# Altium schematic sheet AFE.SchDoc
size A4; SheetNumber: 3; SheetTotal: 6
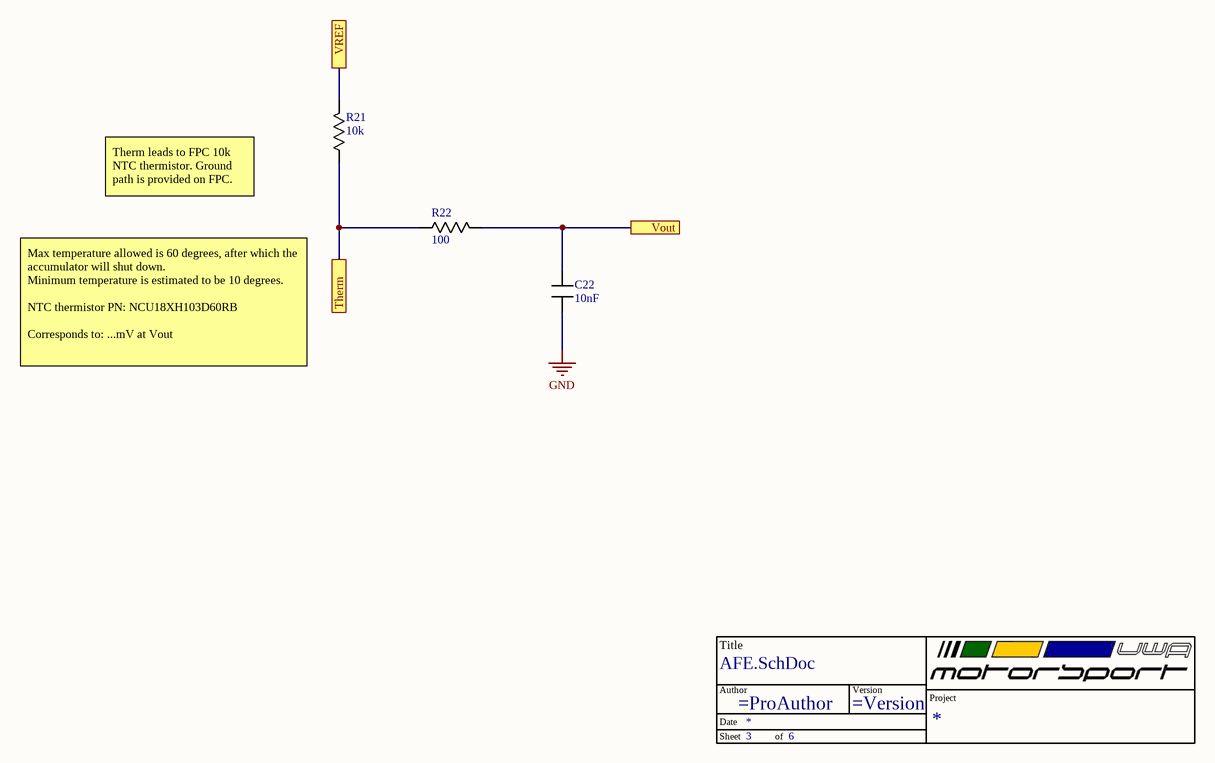
[diagram p0: AFE.SchDoc]

## Parts
*  TitleBlock  (value not drawn)  (graphical)
C22  value 10nF  [C_0603]  (hidden comment: C)
R21  value 10k  [R-0603]  (hidden comment: CRT0603-BY-1002EST)
R22  value 100  [R-0603]  (hidden comment: Resistor)

## Ports
Therm, Vout, VREF

## Nets
GND: C22.1
Therm: R21.1 R22.1 ; port Therm
Vout: C22.2 R22.2 ; port Vout
VREF: R21.2 ; port VREF

## Notes on the sheet
- Therm leads to FPC 10k NTC thermistor. Ground path is provided on FPC.
- Max temperature allowed is 60 degrees, after which the accumulator will shut down.
  Minimum temperature is estimated to be 10 degrees.
  NTC thermistor PN: NCU18XH103D60RB
  Corresponds to: ...mV at Vout
- (in symbol TitleBlock) Title; Author; Version; Project; Date; Sheet; of

## Library data of the parts
C22 = Capacitor: ComponentLink1Description: New link; ComponentLink1URL: *
R21 = Resistor: Res Thin Film 0603 10K Ohm 0.1% 0.1W(1/10W) ±25ppm/C Pad SMD T/R; Manufacturer: Bourns; Resistance: 10kR; Max Power Dissipation: 100mW; Temperature Coefficient: 25ppm/°C; Supplier 1: Mouser; Supplier Part Number 1: 652-CRT0603BY1002EST; Manufacturer Part Number: CRT0603-BY-1002EST; RoHS: Yes; Category: Chip SMD Resistors; Stock 1: 2315; Pricing 1: 1=0.33000, 10=0.15400, 50=0.15400, 100=0.08500, 1000=0.04700, 10000=0.03600 (USD); Case/Package: 0603; Case Code (Imperial): 0603; Case Code (Metric): 1608; Min Operating Temperature: -55°C; Max Operating Temperature: 155°C; Resistor Type: Thin Film; Packaging: Tape and Reel; Tolerance: 0.1%; Number of Terminations: 2; ComponentLink1URL: https://www.bourns.com/docs/Product-Datasheets/CRT-ST.pdf?src-supplier=Digi-Key; ComponentLink1Description: https://www.bourns.com/docs/Product-Datasheets/CRT-ST.pdf?src-supplier=Digi-Key